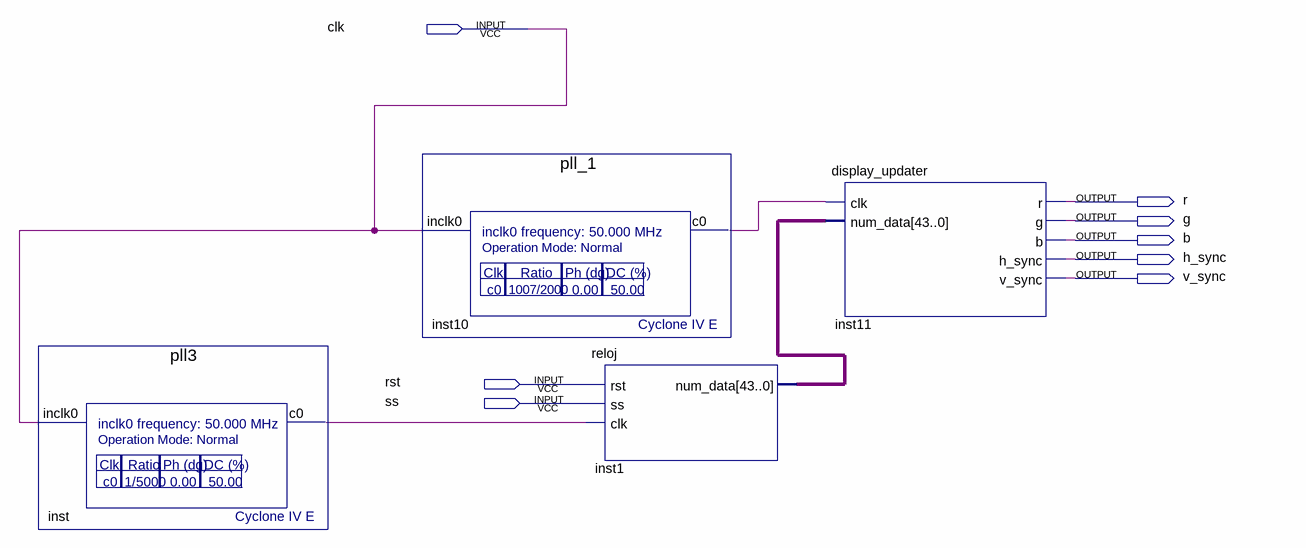
[diagram p0: schematic sheet]
// Quartus schematic tpf_test_01.bdf as structural Verilog: 4 symbols, 8 pins
module tpf_test_01 (
  input  clk,
  input  rst,
  input  ss,
  output r,
  output g,
  output b,
  output h_sync,
  output v_sync
);

  wire inst10_c0, inst_c0;
  wire [43:0] inst1_num_data;

  pll3 inst (.inclk0(clk), .c0(inst_c0));
  pll_1 inst10 (.inclk0(clk), .c0(inst10_c0));
  reloj inst1 (.rst(rst), .ss(ss), .clk(inst_c0), .num_data(inst1_num_data));
  display_updater inst11 (
    .clk(inst10_c0), .num_data(inst1_num_data), .r(r), .g(g), .b(b), .h_sync(h_sync), .v_sync(v_sync));
endmodule
